# EAGLE design B_Arduino_MEGA2560_ref (EAGLE 6.5.0)
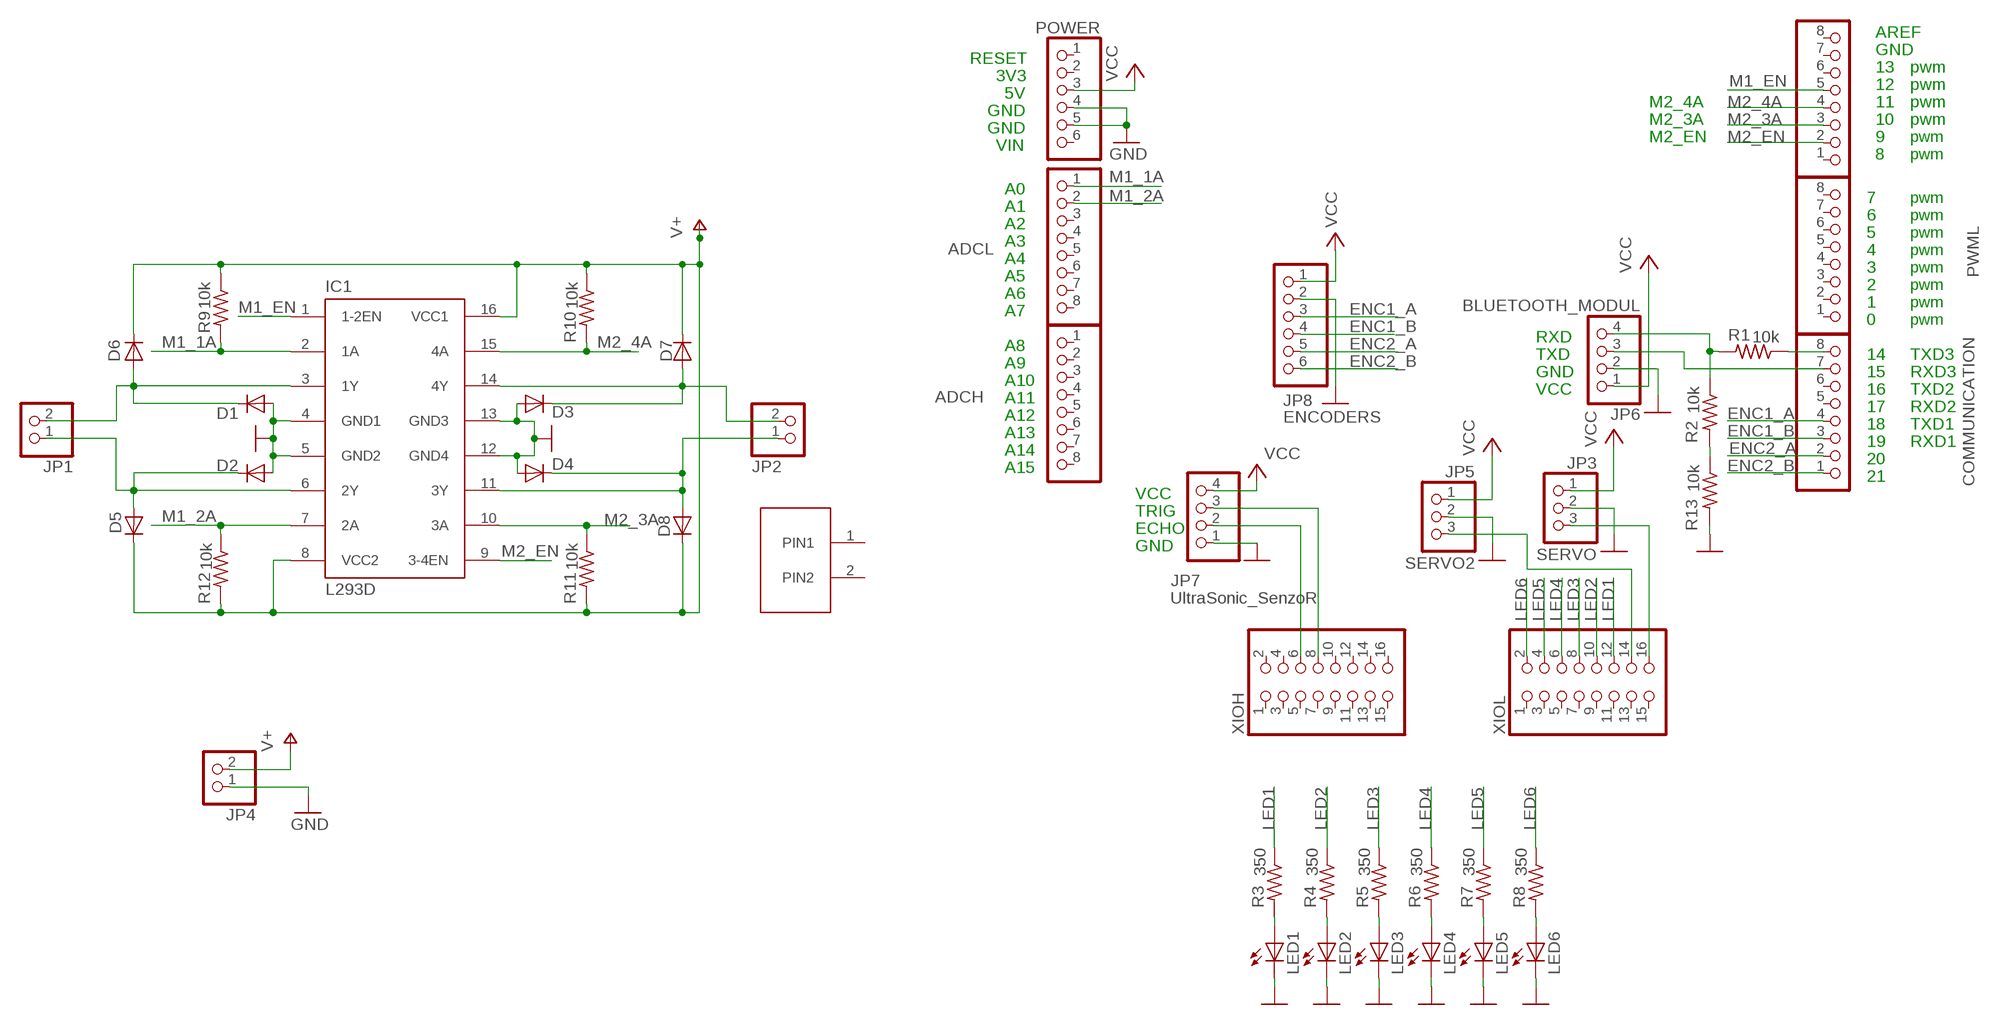
[diagram p0: schematic, sheet 1]

## Parts
ADCH  PINHD-1X8  [1X08]
ADCL  PINHD-1X8  [1X08]
COMMUNICATION  PINHD-1X8  [1X08]
D1  PMLL4150  [SOD80C]
D2  PMLL4150  [SOD80C]
D3  PMLL4150  [SOD80C]
D4  PMLL4150  [SOD80C]
D5  PMLL4150  [SOD80C]
D6  PMLL4150  [SOD80C]
D7  PMLL4150  [SOD80C]
D8  PMLL4150  [SOD80C]
IC1  L293D  [DIL16]
JP1  PINHD-1X2  [1X02]
JP2  PINHD-1X2  [1X02]
JP3  SERVO  PINHD-1X3  [1X03]
JP4  PINHD-1X2  [1X02]
JP5  SERVO2  PINHD-1X3  [1X03]
JP6  BLUETOOTH_MODUL  PINHD-1X4  [1X04]
JP7  UltraSonic_SenzoR  PINHD-1X4  [1X04]
JP8  ENCODERS  PINHD-1X6  [1X06]
LED1  LED  [SMARTLED-TTW]
LED2  LED  [SMARTLED-TTW]
LED3  LED  [SMARTLED-TTW]
LED4  LED  [SMARTLED-TTW]
LED5  LED  [SMARTLED-TTW]
LED6  LED  [SMARTLED-TTW]
POWER  PINHD-1X6  [1X06]
PWMH  PINHD-1X8  [1X08]
PWML  PINHD-1X8  [1X08]
R1  10k  R-US_R0805  [R0805]
R2  10k  R-US_R0805  [R0805]
R3  350  R-US_R0805  [R0805]
R4  350  R-US_R0805  [R0805]
R5  350  R-US_R0805  [R0805]
R6  350  R-US_R0805  [R0805]
R7  350  R-US_R0805  [R0805]
R8  350  R-US_R0805  [R0805]
R9  10k  R-US_R0805  [R0805]
R10  10k  R-US_R0805  [R0805]
R11  10k  R-US_R0805  [R0805]
R12  10k  R-US_R0805  [R0805]
R13  10k  R-US_R0805  [R0805]
U$1  FR_L_PNHD_2  [FR_L_PN_HD-2]
XIOH  PINHD-2X8  [2X08]
XIOL  PINHD-2X8  [2X08]

## Nets
ENC1_A: COMMUNICATION.4 JP8.3
ENC1_B: COMMUNICATION.3 JP8.4
ENC2_A: COMMUNICATION.2 JP8.5
ENC2_B: COMMUNICATION.1 JP8.6
GND [Ground]: D1.A D2.A D3.A D4.A IC1.4(GND1) IC1.5(GND2) IC1.12(GND4) IC1.13(GND3) JP3.2 JP4.1 JP5.2 JP6.2 JP7.1 JP8.2 LED1.C@1(C) LED2.C@1(C) LED3.C@1(C) LED4.C@1(C) LED5.C@1(C) LED6.C@1(C) POWER.4 POWER.5 R13.2
LED1: R3.1 XIOL.12
LED2: R4.1 XIOL.10
LED3: R5.1 XIOL.8
LED4: R6.1 XIOL.6
LED5: R7.1 XIOL.4
LED6: R8.1 XIOL.2
M1_1A: ADCL.1 IC1.2(1A) R9.2
M1_2A: ADCL.2 IC1.7(2A) R12.1
M1_EN: IC1.1(1-2EN) PWMH.5
M2_3A: IC1.10(3A) PWMH.3 R11.1
M2_4A: IC1.15(4A) PWMH.4 R10.2
M2_EN: IC1.9(3-4EN) PWMH.2
N$1: D1.C D6.A IC1.3(1Y) JP1.2
N$2: D2.C D5.A IC1.6(2Y) JP1.1
N$3: D3.C D7.A IC1.14(4Y) JP2.2
N$4: D4.C D8.A IC1.11(3Y) JP2.1
N$5: JP3.3 XIOL.16
N$6: COMMUNICATION.7 JP6.3
N$7: COMMUNICATION.8 R1.1
N$8: JP6.4 R1.2 R2.1
N$9: R2.2 R13.1
N$10: JP7.3 XIOH.8
N$11: JP7.2 XIOH.6
N$12: LED1.A@1(A) R3.2
N$13: LED2.A@1(A) R4.2
N$14: LED3.A@1(A) R5.2
N$15: LED4.A@1(A) R6.2
N$16: LED5.A@1(A) R7.2
N$17: LED6.A@1(A) R8.2
N$18: JP5.3 XIOL.14
V+: D5.C D6.C D7.C D8.C IC1.8(VCC2) IC1.16(VCC1) JP4.2 R9.1 R10.1 R11.2 R12.2
VCC [VCC_]: JP3.1 JP5.1 JP6.1 JP7.4 JP8.1 POWER.3
Unconnected: ADCH.1 ADCH.2 ADCH.3 ADCH.4 ADCH.5 ADCH.6 ADCH.7 ADCH.8 ADCL.3 ADCL.4 ADCL.5 ADCL.6 ADCL.7 ADCL.8 COMMUNICATION.5 COMMUNICATION.6 POWER.1 POWER.2 POWER.6 PWMH.1 PWMH.6 PWMH.7 PWMH.8 PWML.1 PWML.2 PWML.3 PWML.4 PWML.5 PWML.6 PWML.7 PWML.8 U$1.1(PIN1) U$1.2(PIN2) XIOH.1 XIOH.2 XIOH.3 XIOH.4 XIOH.5 XIOH.7 XIOH.9 XIOH.10 XIOH.11 XIOH.12 XIOH.13 XIOH.14 XIOH.15 XIOH.16 XIOL.1 XIOL.3 XIOL.5 XIOL.7 XIOL.9 XIOL.11 XIOL.13 XIOL.15

## Notes on the sheet
- AREF
- GND
- RESET
- 13 | pwm
- 3V3
- 12 | pwm
- 5V
- M2_4A | 11 | pwm
- GND
- M2_3A | 10 | pwm
- GND
- M2_EN | 9 | pwm
- VIN
- 8 | pwm
- A0
- 7 | pwm
- A1
- 6 | pwm
- A2
- 5 | pwm
- A3
- 4 | pwm
- A4
- 3 | pwm
- A5
- 2 | pwm
- A6
- 1 | pwm
- A7
- 0 | pwm
- RXD
- A8
- TXD | 14 | TXD3
- A9
- GND | 15 | RXD3
- A10
- VCC | 16 | TXD2
- A11
- 17 | RXD2
- A12
- 18 | TXD1
- A13
- 19 | RXD1
- A14
- 20
- A15
- 21
- VCC
- TRIG
- ECHO
- GND

## Library data of the parts
ADCH ADCL COMMUNICATION PWMH PWML = pinhead:PINHD-1X8: PIN HEADER
D1-D8 = diode:PMLL4150: DIODE high speed
IC1 = st-microelectronics:L293D: PUSH-PULL 4 CHANNEL DRIVER; MPN: L293D; OC_FARNELL: 9589619; OC_NEWARK: 56P8249
JP1 JP2 JP4 = pinhead:PINHD-1X2: PIN HEADER
JP3 JP5 = pinhead:PINHD-1X3: PIN HEADER
JP6 JP7 = pinhead:PINHD-1X4: PIN HEADER
JP8 POWER = pinhead:PINHD-1X6: PIN HEADER
LED1-LED6 = adafruit:LED: LED OSRAM: - CHIPLED LG R971, LG N971, LY N971, LG Q971, LY Q971, LO R971, LY R971 LH N974, LH R974 LS Q976, LO Q976, LY Q976 LO Q996 - Hyper CHIPLED LW Q18S LB Q993, LB Q99A, LB R99A - SideLED LS A670, LO A670, LY A670, LG A670, LP A670 LB A673, LV A673, LT A673, LW A673 LH A674 LY A675 LS A676, LA A676, LO A676, LY A676, LW A676 LS A679, LY A679, LG A679 - Hyper Micro SIDELED® LS Y876, LA Y876, LO Y876, LY Y876 LT Y87S - SmartLED LW L88C, LW L88S LB L89C, LB L89S, LG L890 LS L89K, LO L89K, LY L89K LS L896, LA L896, LO L896, LY L896 - TOPLED LS T670, LO T670, LY T670, LG T670, LP T670 LSG T670, LSP T670, LSY T670, LOP T670, LYG T670 LG T671, LOG T671, LSG T671 LB T673, LV T673, LT T673, LW T673 LH T674 LS T676, LA T676, LO T676, LY T676, LB T676, LH T676, LSB T676, LW T676 LB T67C, LV T67C, LT T67C, LS T67K, LO T67K, LY T67K, LW E67C LS E67B, LA E67B, LO E67B, LY E67B, LB E67C, LV E67C, LT E67C LW T67C LS T679, LY T679, LG T679 LS T770, LO T770, LY T770, LG T770, LP T770 LB T773, LV T773, LT T773, LW T773 LH T774 LS E675, LA E675, LY E675, LS T675 LS T776, LA T776, LO T776, LY T776, LB T776 LHGB T686 LT T68C, LB T68C - Hyper Mini TOPLED® LB M676 - Mini TOPLED Santana® LG M470 LS M47K, LO M47K, LY M47K Source: http://www.osram.convergy.de/
R1-R13 = adafruit:R-US_: RESISTOR, American symbol
U$1 = my_lib:FR_L_PNHD_2
XIOH XIOL = pinhead:PINHD-2X8: PIN HEADER

## Net classes
0 default: width 0.508 mm, drill 20 mm, clearance 0.2 mm
1 Ground: width 1.016 mm, drill 20 mm, clearance 0.2 mm
2 VCC_: width 1.016 mm, drill 20 mm, clearance 0.2 mm

## Board
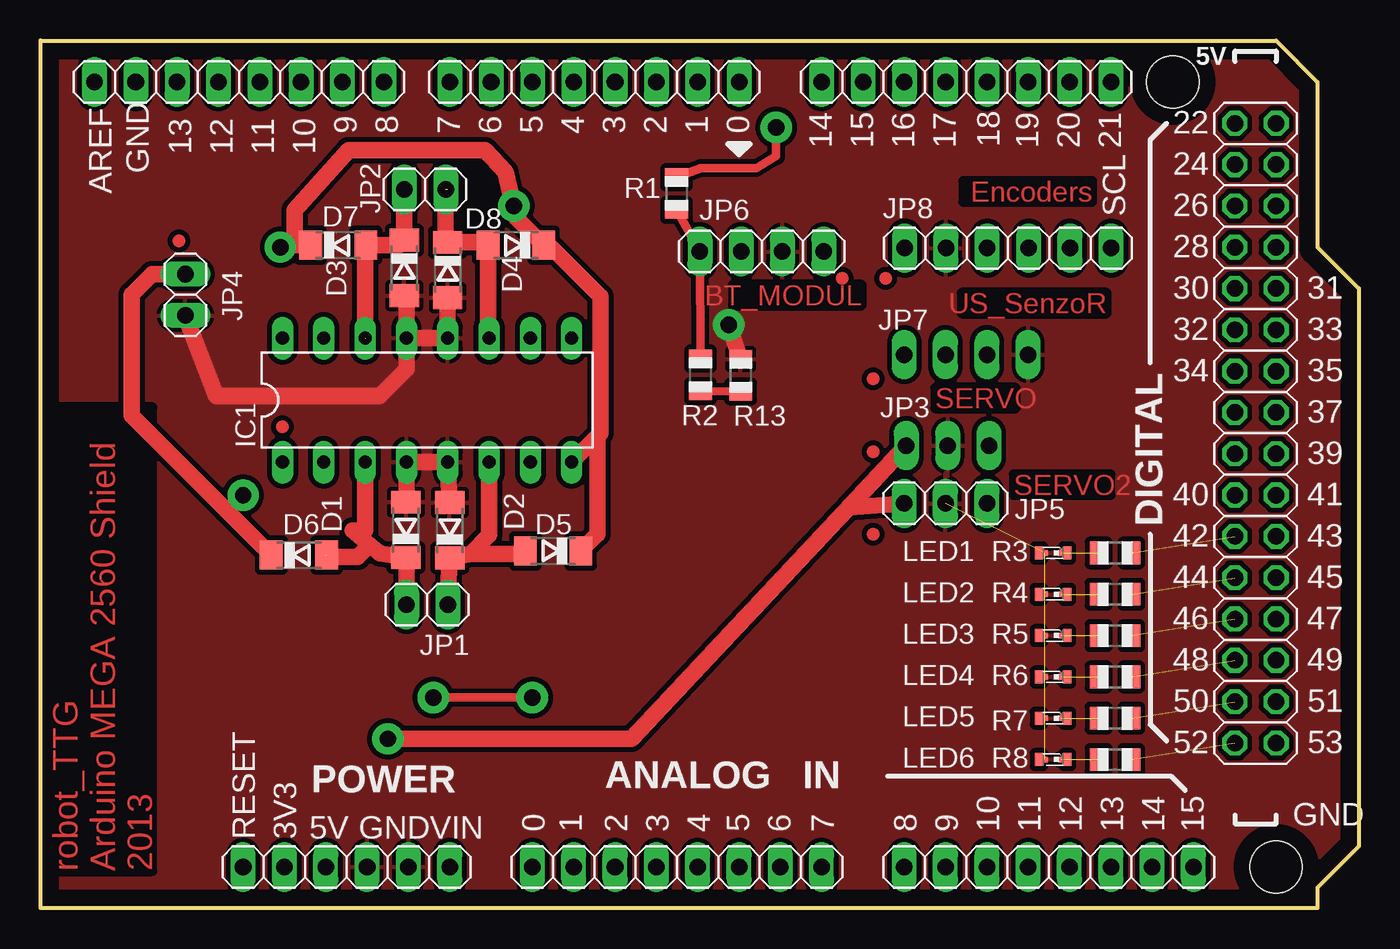
[diagram p1: board, top side]
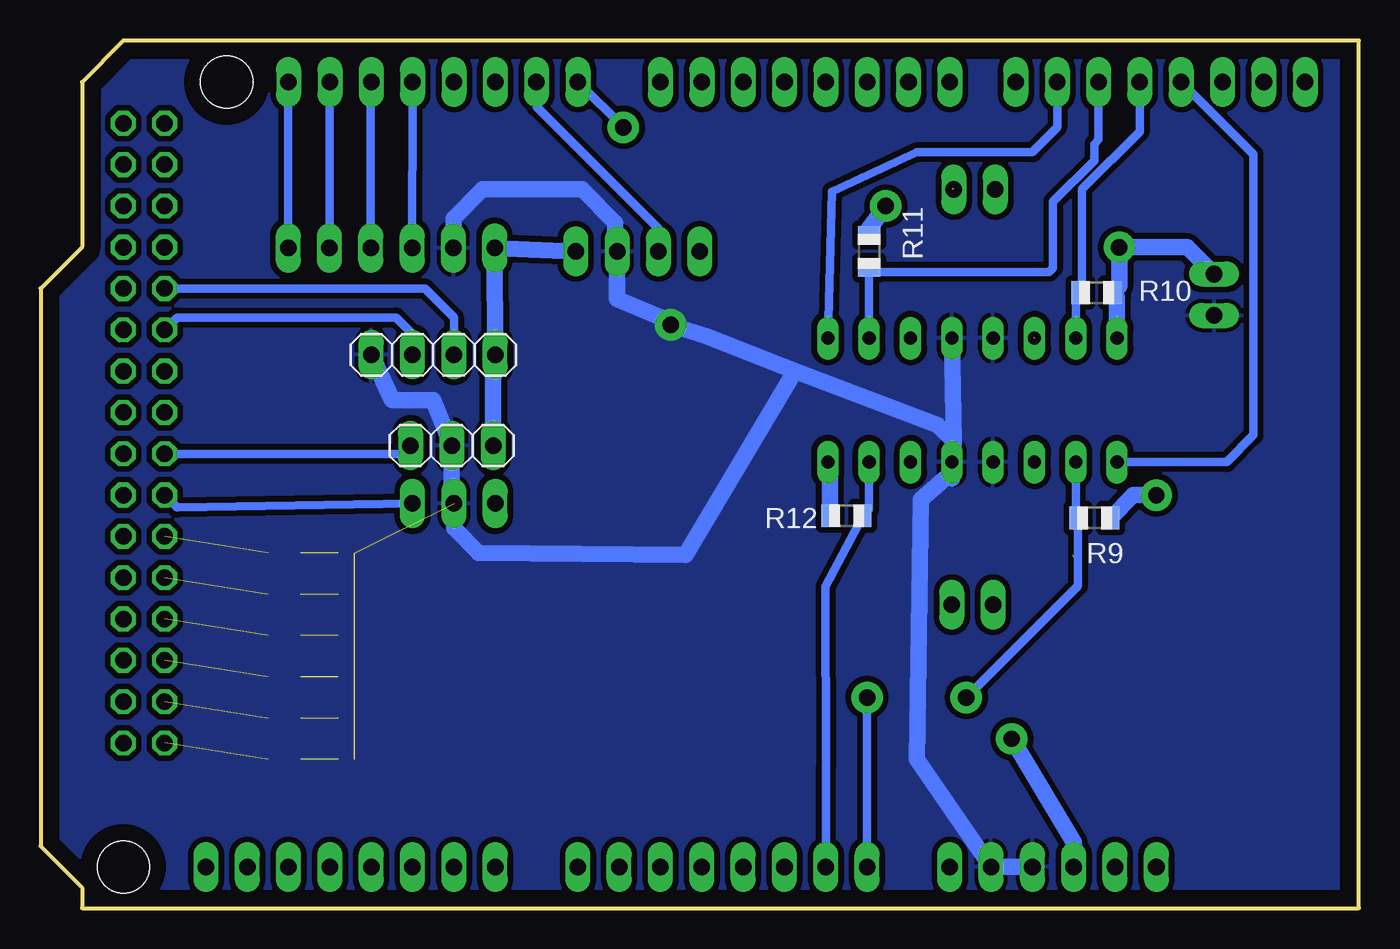
[diagram p2: board, bottom side, seen from below]

Size 81.03 x 53.34 mm. Coordinates in mm from the lower left corner, seen from the top.
Outline: 0,53.34 75.95,53.34 78.49,50.8 78.49,40.64 81.03,38.1 81.03,3.81 78.49,1.27 78.49,0 0,0 0,53.34
Copper layers (1*16): Top 0.035mm / dielectric 1.5mm / Bottom 0.035mm
Design rules "default *": minimum track width 6mil, minimum drill 12mil, track to track 0.2mm, track to pad 0.2mm, pad to pad 0.2mm, via to via 0.2mm, smd to smd 0.2mm, copper to edge 40mil, drill to drill 12mil, minimum pad ring 10mil, minimum via ring 10mil, stop-mask expansion 2mil, vias tented up to drill 1mil, thermal gap 10mil
Holes 3.2 mm at 75.95,2.54 -5.33,50.8 69.6,50.8 -6.6,2.54

### Footprints (pad centres in the part's own frame; a part is rotated, then mirrored left to right if it is on the bottom)
1X08 = drill 1.016 long: 1 -8.89,0; 2 -6.35,0; 3 -3.81,0; 4 -1.27,0; 5 1.27,0; 6 3.81,0; 7 6.35,0; 8 8.89,0
SOD80C = smd 1.4 x 1.8: A 1.7,0; C -1.7,0
DIL16 = drill 0.813 long: 1 -8.89,-3.81; 2 -6.35,-3.81; 3 -3.81,-3.81; 4 -1.27,-3.81; 5 1.27,-3.81; 6 3.81,-3.81; 7 6.35,-3.81; 8 8.89,-3.81; 9 8.89,3.81; 10 6.35,3.81; 11 3.81,3.81; 12 1.27,3.81; 13 -1.27,3.81; 14 -3.81,3.81; 15 -6.35,3.81; 16 -8.89,3.81
1X02 = drill 1.016 long: 1 -1.27,0; 2 1.27,0
1X03 = drill 1.016 long: 1 -2.54,0; 2 0,0; 3 2.54,0
1X04 = drill 1.016 long: 1 -3.81,0; 2 -1.27,0; 3 1.27,0; 4 3.81,0
1X06 = drill 1.016 long: 1 -6.35,0; 2 -3.81,0; 3 -1.27,0; 4 1.27,0; 5 3.81,0; 6 6.35,0
SMARTLED-TTW = smd 0.8 x 0.5: A 0,-0.875; C 0,0.875 | smd 0.35 x 0.35: A@1 0,-0.5; C@1 0,0.5
R0805 = smd 1.1 x 1.4: 1 -1,0; 2 1,0
FR_L_PN_HD-2 = drill 0.9 pad 1.93 octagon: 1 1,-1; 2 1,-4.5
2X08 = drill 1.016 octagon: 1 -8.89,-1.27; 2 -8.89,1.27; 3 -6.35,-1.27; 4 -6.35,1.27; 5 -3.81,-1.27; 6 -3.81,1.27; 7 -1.27,-1.27; 8 -1.27,1.27; 9 1.27,-1.27; 10 1.27,1.27; 11 3.81,-1.27; 12 3.81,1.27; 13 6.35,-1.27; 14 6.35,1.27; 15 8.89,-1.27; 16 8.89,1.27

### Placement (x,y rotation side)
ADCH  61.98,2.54 0 top
ADCL  39.12,2.54 0 top
COMMUNICATION  56.9,50.8 180 top
D1  22.45,23.27 90 top
D2  25.15,23.24 90 top
D3  22.35,39.37 270 top
D4  25.02,39.24 270 top
D5  31.5,21.97 180 top
D6  15.87,21.72 0 top
D7  18.29,40.77 0 top
D8  29.21,40.77 180 top
IC1  23.75,31.24 0 top
JP1  23.75,18.67 180 top
JP2  23.62,44.2 180 top
JP3  55.75,28.45 180 bottom
JP4  8.89,37.72 90 top
JP5  55.63,24.89 0 top
JP6  44.32,40.39 180 top
JP7  56.9,34.04 0 bottom
JP8  59.46,40.59 0 top
LED1  62.23,21.84 90 top
LED2  62.23,19.3 90 top
LED3  62.23,16.76 90 top
LED4  62.23,14.22 90 top
LED5  62.23,11.68 90 top
LED6  62.23,9.14 90 top
POWER  18.8,2.54 0 top
PWMH  12.19,50.8 180 top
PWML  34.04,50.8 180 top
R1  39.09,43.94 270 top
R2  40.56,32.79 270 top
R3  66.04,21.84 180 top
R4  66.04,19.3 180 top
R5  66.04,16.76 180 top
R6  66.04,14.22 180 top
R7  66.04,11.68 180 top
R8  66.04,9.14 180 top
R9  16.26,24 180 bottom
R10  16.13,37.85 180 bottom
R11  30.1,40.39 90 bottom
R12  31.5,24.13 180 bottom
R13  43.03,32.77 90 top
U$1  -11.94,5.08 0 top  (outside the outline)
XIOH  74.68,39.37 90 top
XIOL  74.68,19.05 90 top

### Tracks (layer width: path | path; a pad name or v marks a point on that pad's centre or on a via)
ENC1_A
  Bottom 0.508: COMMUNICATION.4 58.17,50.11 JP8.3
ENC1_B
  Bottom 0.508: COMMUNICATION.3 60.73,50.77 JP8.4
ENC2_A
  Bottom 0.508: COMMUNICATION.2 63.27,50.77 JP8.5
ENC2_B
  Bottom 0.508: COMMUNICATION.1 65.81,50.77 JP8.6
GND  (via drill 1 pad 1.93)  (6 unrouted)
  Top 1.016: IC1.13 IC1.12 D4.A | D1.A 22.48,25.25 IC1.4 IC1.5 D2.A | JP4.1 10.79,31.5 20.83,31.5 22.48,33.15 IC1.13 | D3.A 22.48,37.54 IC1.13 | v42.29,35.87 R13.2
  Bottom 1.016: IC1.12 24.89,28.7 | 24.89,28.7 IC1.5 | 34.67,33.02 40.13,35.18 v42.29,35.87 42.14,36.02 45.59,37.47 JP6.2 45.72,40.51 45.72,42.16 47.75,44.2 53.85,44.2 55.65,42.39 JP8.2 | 34.67,33.02 25.91,29.72 24.89,28.7 | 34.67,33.02 41.4,21.72 54.1,21.84 55.63,23.37 JP5.2 55.75,24.77 JP3.2 56.9,31.24 59.44,31.24 JP7.1 | POWER.4 POWER.5 27.18,9.14 26.92,25.15 25.02,26.8 IC1.5 | 25.02,26.42 IC1.5
  pour Top (isolate 0.305, rank 2): 82.3,53.59 81.79,-1.4 1.4,-1.02 -0.25,-0.76 -0.25,53.72
  pour Bottom (isolate 0.356, rank 2): 82.42,53.85 81.92,-0.76 -0.76,-0.76 -0.64,0.51 -0.51,49.53 -0.38,53.98
LED1  (1 unrouted)
LED2  (1 unrouted)
LED3  (1 unrouted)
LED4  (1 unrouted)
LED5  (1 unrouted)
LED6  (1 unrouted)
M1_1A  (via drill 1 pad 1.93)
  Top 0.508: v24.13,12.95 v30.23,12.95
  Bottom 0.508: IC1.2 17.4,24.15 R9.2 17.26,19.83 v24.13,12.95 | v30.23,12.95 ADCL.1
M1_2A
  Bottom 0.508: IC1.7 30.1,24.53 R12.1 32.78,19.8 32.77,8.64 ADCL.2
M1_EN
  Bottom 0.508: PWMH.5 6.48,46.35 6.48,29.08 8.13,27.43 IC1.1
M2_3A
  Bottom 0.508: PWMH.3 16,47.24 16.26,46.99 16.26,45.97 18.8,43.43 18.8,39.37 19.05,39.12 29.83,39.12 R11.1 IC1.10
M2_4A
  Bottom 0.508: IC1.15 17.4,37.58 R10.2 17.02,37.96 17.02,44.2 13.46,47.75 PWMH.4
M2_EN
  Bottom 0.508: PWMH.2 18.54,48.01 20.07,46.48 27.18,46.48 32.39,44.07 IC1.9
N$1  (1 unrouted)
  Top 1.016: IC1.3 19.94,23.24 19.18,23.24 20.23,22.34 | 20.23,22.34 20.85,21.82 D1.C 22.48,21.8 JP1.2 | 17.53,21.59 19.48,21.59 20.23,22.34
N$2
  Top 1.016: JP1.1 D2.C 26.42,21.8 | 26.42,21.8 29.62,21.8 D5.A | IC1.6 27.56,22.94 26.42,21.8
N$3  (1 unrouted)
  Top 1.016: IC1.14 19.94,40.72 D7.A 22.05,40.77 D3.C JP2.2
N$4  (1 unrouted)
  Top 0.508: 25.02,40.77 D4.C
  Top 1.016: JP2.1 24.89,41.07 D4.C 27.33,40.94 D8.A 27.51,35.1 IC1.11
N$5
  Bottom 0.508: JP3.3 58.8,27.94 XIOL.16
N$6
  Bottom 0.508: COMMUNICATION.7 50.55,49.28 43.05,41.78 JP6.3
N$7  (via drill 1 pad 1.93)
  Top 0.508: v45.21,48.01 45.21,46.23 43.99,45.52 40.58,45.52 R1.1
  Bottom 0.508: COMMUNICATION.8 v45.21,48.01
N$8
  Top 0.508: R1.2 JP6.4 R2.1
N$9
  Top 0.508: R2.2 R13.1
N$10
  Bottom 0.508: XIOH.8 57.4,38.1 55.63,36.32 JP7.3
N$11
  Bottom 0.508: XIOH.6 72.64,36.32 59.18,36.32 58.17,35.31 JP7.2
N$12  (1 unrouted)
N$13  (1 unrouted)
N$14  (1 unrouted)
N$15  (1 unrouted)
N$16  (1 unrouted)
N$17  (1 unrouted)
N$18
  Bottom 0.508: JP5.3 72.64,24.64 XIOL.14
V+  (via drill 1 pad 1.9, 1 pad 1.93)
  Top 1.016: D7.C 15.62,40.77 | 15.62,40.77 14.73,40.77 v14.73,40.64 | 29.21,42.47 D8.C 31.24,40.77 34.42,37.59 34.42,29.21 34.23,29.02 | 29.21,42.47 v29.08,43.18 | IC1.8 34.23,29.02 | 29.21,42.47 28.57,45.26 27.3,46.61 18.92,46.61 15.62,42.93 15.62,40.77 | D6.C 11.41,24.49 | 11.41,24.49 5.59,30.3 5.59,37.72 6.86,38.99 JP4.2 | v12.45,25.4 11.53,24.49 11.41,24.49 | D5.C 34.23,23 34.23,29.02
  Bottom 1.016: v29.08,43.18 30.1,41.78 R11.2 | R12.2 32.5,27.29 IC1.8 | JP4.2 10.54,40.64 v14.73,40.64 14.73,38.24 R10.1 14.86,37.58 IC1.16 | R9.1 13.86,25.4 v12.45,25.4
VCC  (via drill 1 pad 1.93)
  Top 1.016: v21.34,10.41 36.32,10.41 48.97,23.91 | 48.97,23.91 JP3.1 | JP5.1 49.69,24.64 48.97,23.91
  Bottom 1.016: POWER.3 17.53,4.06 v21.34,10.41 | JP3.1 53.21,33.91 JP7.4 JP8.1 JP6.1
(copper drawn outside any net)
  shapes: Top circle x7

### Text on the board
Top: Encoders | BT_MODUL | US_SenzoR | SERVO | SERVO2 | robot_TTG / Arduino MEGA 2560 Shield / 2013
tPlace: 18 | 9 | 8 | 7 | 6 | 5 | 4 | 3 | 2 | 1 | 0 | 22 | 14 | 15 | 16 | 17 | 19 | 20 | 21 | 13 | 12 | 11 | 10 | 24 | 26 | 28 | 30 | 31 | 32 | 33 | 34 | 35 | 37 | 39 | 40 | 41 | 42 | 43 | 44 | 45 | 46 | 47 | 48 | 49 | 50 | 51 | 52 | 53 | 0 | 1 | 2 | 3 | 4 | 5 | 6 | 7 | 8 | 9 | 10 | 11 | 12 | 13 | 14 | 15
tNames: 5V | GND | AREF | SCL | DIGITAL | ANALOG IN | GND | RESET | 3V3 | 5V | GND | VIN
ReferenceLC: L | TX | RX | PC1 | PC2